# EAGLE design LNB (EAGLE 7.3.0)

## Sheet 1 of 2
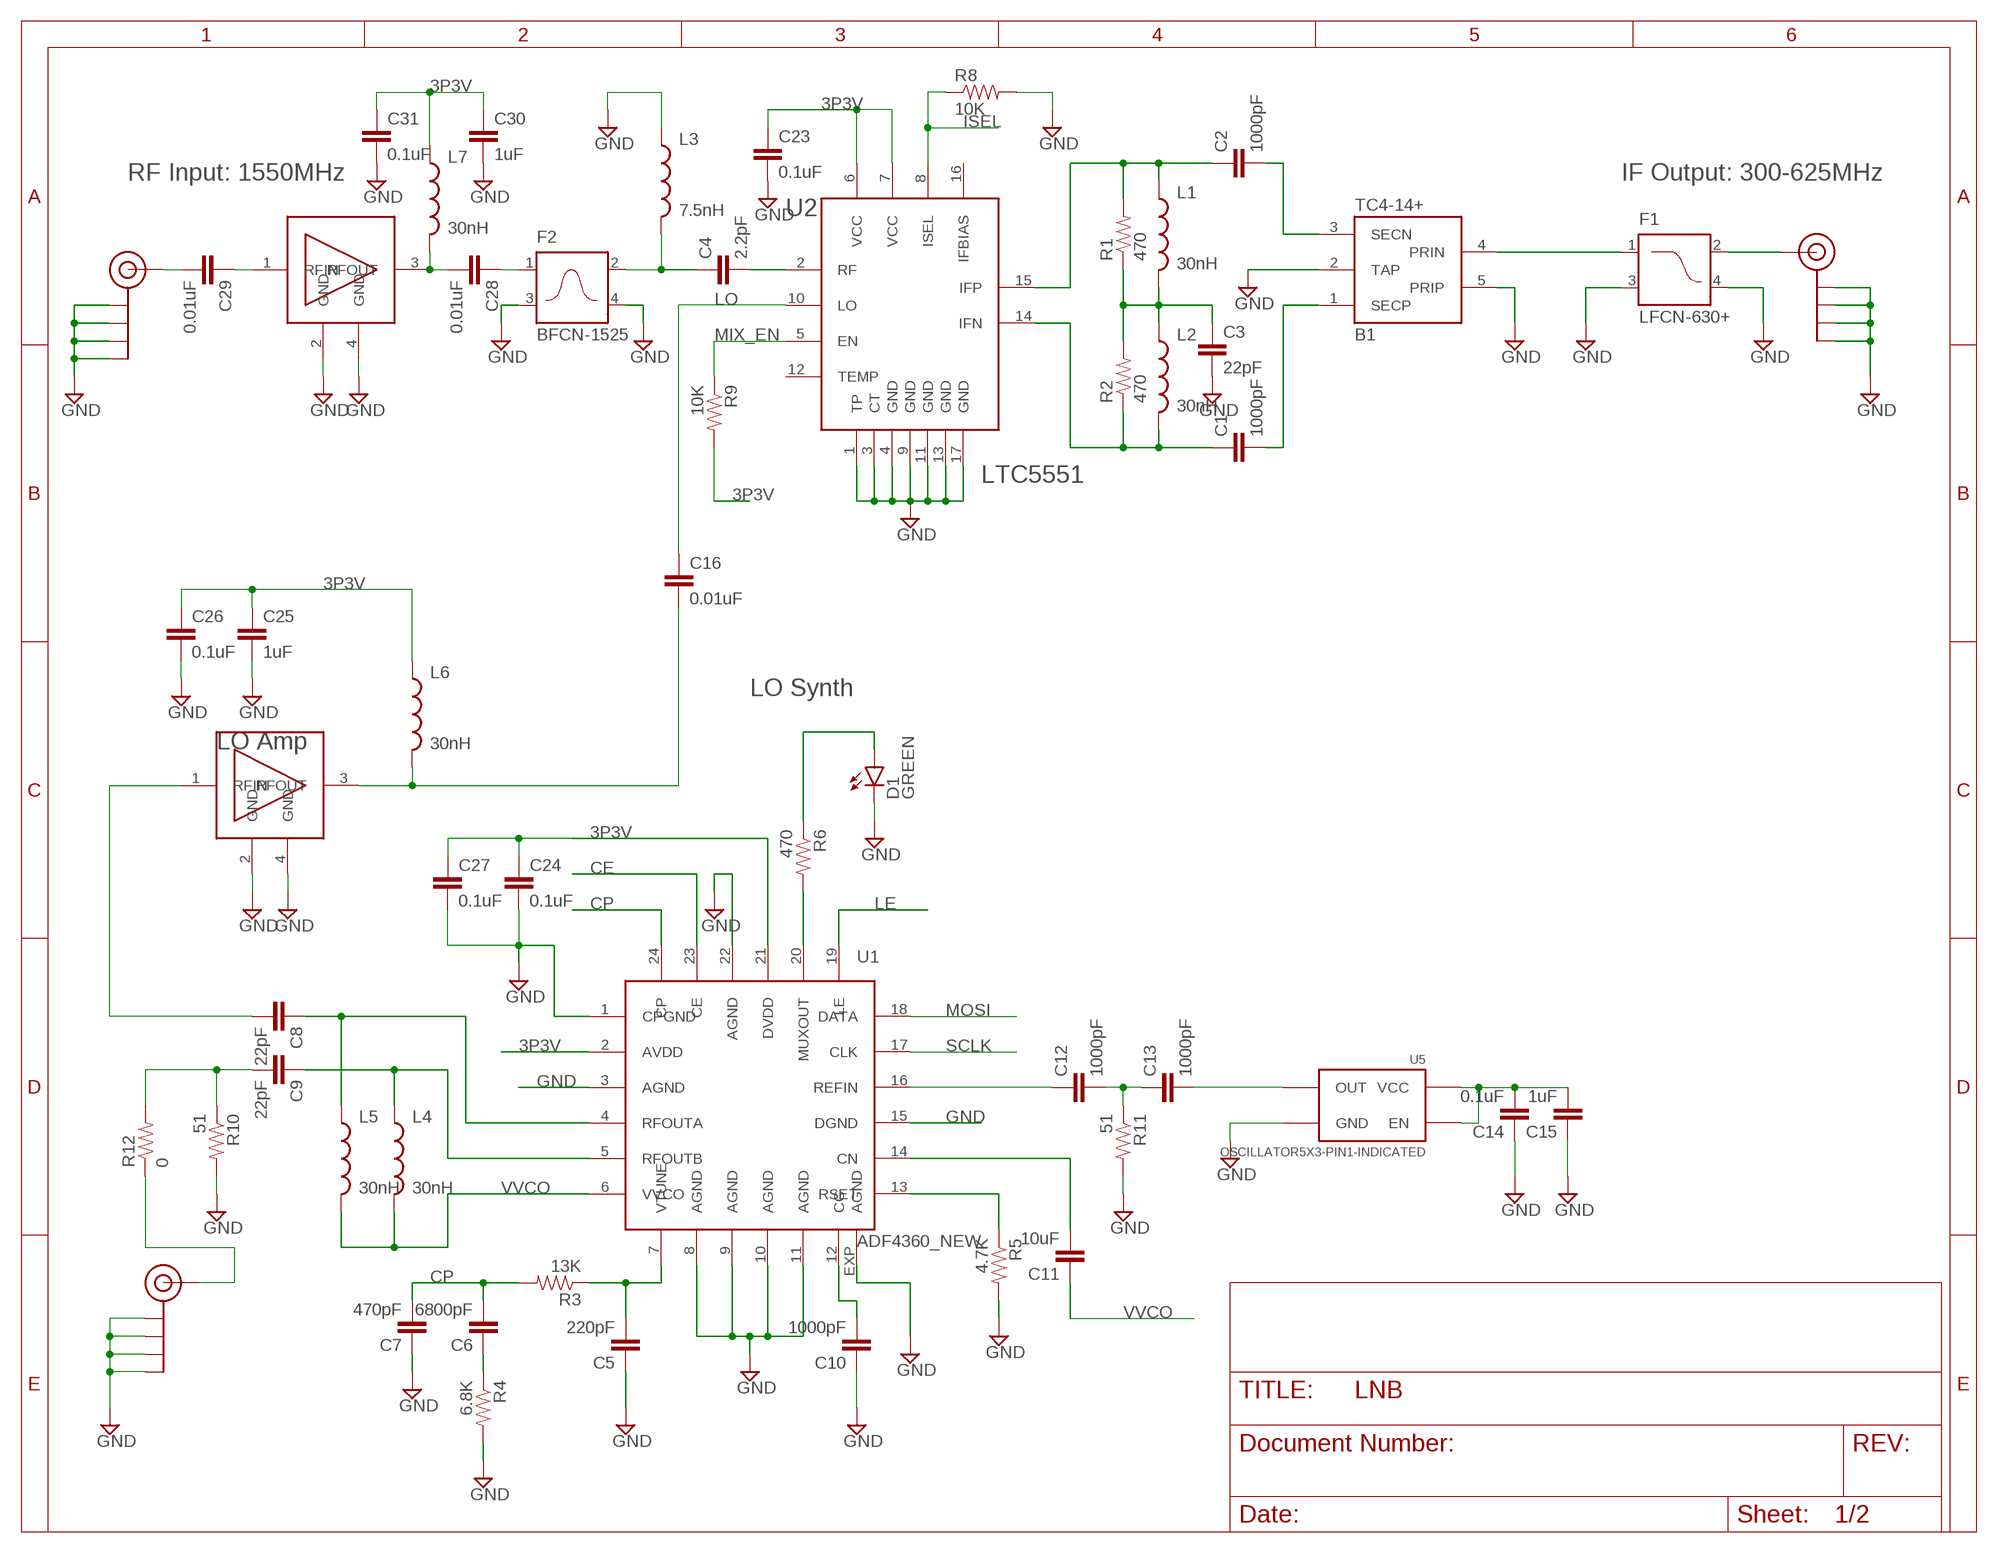
[diagram p0: schematic, sheet 1]

### Parts
B1  TC4-14+  [AT224-1]
C1  1000pF  CAP0603-CAP  [0603-CAP]
C2  1000pF  CAP0603-CAP  [0603-CAP]
C3  22pF  CAP0603-CAP  [0603-CAP]
C4  2.2pF  CAP0603-CAP  [0603-CAP]
C5  220pF  CAP0603-CAP  [0603-CAP]
C6  6800pF  CAP0603-CAP  [0603-CAP]
C7  470pF  CAP0603-CAP  [0603-CAP]
C8  22pF  CAP0603-CAP  [0603-CAP]
C9  22pF  CAP0603-CAP  [0603-CAP]
C10  1000pF  CAP0603-CAP  [0603-CAP]
C11  10uF  CAP0603-CAP  [0603-CAP]
C12  1000pF  CAP0603-CAP  [0603-CAP]
C13  1000pF  CAP0603-CAP  [0603-CAP]
C14  0.1uF  CAP0603-CAP  [0603-CAP]
C15  1uF  CAP0603-CAP  [0603-CAP]
C16  0.01uF  CAP0603-CAP  [0603-CAP]
C23  0.1uF  CAP0603-CAP  [0603-CAP]
C24  0.1uF  CAP0603-CAP  [0603-CAP]
C25  1uF  CAP1206  [1206]
C26  0.1uF  CAP0603-CAP  [0603-CAP]
C27  0.1uF  CAP0603-CAP  [0603-CAP]
C28  0.01uF  CAP0603-CAP  [0603-CAP]
C29  0.01uF  CAP0603-CAP  [0603-CAP]
C30  1uF  CAP1206  [1206]
C31  0.1uF  CAP0603-CAP  [0603-CAP]
D1  GREEN  LED-GREEN0603  [LED-0603]
F1  LFCN-630+  [FV1206_MC]
F2  BFCN-1525  [FV1206_MC]
J2  SMA_EDGE  [SMA-EDGE]
J3  SMA_EDGE  [SMA-EDGE]
J$1  SMA_EDGE  [SMA-EDGE]
L1  30nH  INDUCTOR30OHM,1.8A  [0603]
L2  30nH  INDUCTOR30OHM,1.8A  [0603]
L3  7.5nH  INDUCTOR30OHM,1.8A  [0603]
L4  30nH  INDUCTOR30OHM,1.8A  [0603]
L5  30nH  INDUCTOR30OHM,1.8A  [0603]
L6  30nH  INDUCTOR30OHM,1.8A  [0603]
L7  30nH  INDUCTOR30OHM,1.8A  [0603]
R1  470  RESISTOR0603-RES  [0603-RES]
R2  470  RESISTOR0603-RES  [0603-RES]
R3  13K  RESISTOR0603-RES  [0603-RES]
R4  6.8K  RESISTOR0603-RES  [0603-RES]
R5  4.7K  RESISTOR0603-RES  [0603-RES]
R6  470  RESISTOR0603-RES  [0603-RES]
R8  10K  RESISTOR0603-RES  [0603-RES]
R9  10K  RESISTOR0603-RES  [0603-RES]
R10  51  RESISTOR0603-RES  [0603-RES]
R11  51  RESISTOR0603-RES  [0603-RES]
R12  0  RESISTOR0603-RES  [0603-RES]
U1  ADF4360_NEW  [LFCSP24]
U2  LTC5551  [QFN16-4X4]
U5  OSCILLATOR5X3-PIN1-INDICATED  [CRYSTAL-OSC-SMD-5X3]
U6  PGA-105+  [SOT-89]
U7  PGA-105+  [SOT-89]

### Nets
3P3V: C14.2 C15.2 C23.1 C24.1 C25.1 C26.1 C27.1 C30.1 C31.1 L6.1 L7.1 R9.2 U1.2(AVDD) U1.21(DVDD) U2.6(VCC) U2.7(VCC) U5.1(EN) U5.4(VCC) ; also sheet 2
CE: U1.23(CE) ; also sheet 2
CP: C6.2 C7.2 R3.2 U1.24(CP)
GND: B1.2(TAP) B1.5(PRIP) C3.2 C5.1 C7.1 C10.1 C14.1 C15.1 C23.2 C24.2 C25.2 C26.2 C27.2 C30.2 C31.2 D1.C F1.3(GND) F1.4(GND) F2.3(GND) F2.4(GND) J2.GND@0(GND) J2.GND@1(GND) J2.GND@2(GND) J2.GND@3(GND) J3.GND@0(GND) J3.GND@1(GND) J3.GND@2(GND) J3.GND@3(GND) J$1.GND@0(GND) J$1.GND@1(GND) J$1.GND@2(GND) J$1.GND@3(GND) L3.1 R4.2 R5.2 R8.2 R10.2 R11.2 U1.1(CPGND) U1.3(AGND) U1.8(AGND) U1.9(AGND) U1.10(AGND) U1.11(AGND) U1.15(DGND) U1.22(AGND) U1.EXP(AGND) U2.1(TP) U2.3(CT) U2.4(GND) U2.9(GND) U2.11(GND) U2.13(GND) U2.17(GND) U5.2(GND) U6.2(GND) U6.4(GND) U7.2(GND) U7.4(GND) ; also sheet 2
ISEL: R8.1 U2.8(ISEL) ; also sheet 2
LE: U1.19(LE) ; also sheet 2
LO: C16.1 U2.10(LO)
LO_IN: C8.2 U7.1(RFIN)
MIX_EN: R9.1 U2.5(EN) ; also sheet 2
MOSI: U1.18(DATA) ; also sheet 2
N$1: C2.1 L1.1 R1.2 U2.15(IFP)
N$2: C1.1 L2.2 R2.1 U2.14(IFN)
N$3: C3.1 L1.2 L2.1 R1.1 R2.2
N$4: B1.1(SECP) C1.2
N$5: B1.3(SECN) C2.2
N$6: B1.4(PRIN) F1.1(IN)
N$7: F1.2(OUT) J$1.SIG(SIGNAL)
N$8: C29.2 J2.SIG(SIGNAL)
N$9: C4.1 F2.2(OUT) L3.2
N$10: C4.2 U2.2(RF)
N$11: C5.2 R3.1 U1.7(VTUNE)
N$12: C11.2 U1.14(CN)
N$13: C6.1 R4.1
N$14: C8.1 L5.1 U1.4(RFOUTA)
N$15: C9.1 L4.1 U1.5(RFOUTB)
N$16: C10.2 U1.12(CC)
N$17: D1.A R6.1
N$18: R5.1 U1.13(RSET)
N$19: R6.2 U1.20(MUXOUT)
N$21: C9.2 R10.1 R12.2
N$23: C29.1 U6.1(RFIN)
N$25: C12.2 C13.1 R11.1
N$26: C13.2 U5.3(OUT)
N$27: C12.1 U1.16(REFIN)
N$28: C16.2 L6.2 U7.3(RFOUT)
N$31: J3.SIG(SIGNAL) R12.1
N$33: C28.2 L7.2 U6.3(RFOUT)
N$34: C28.1 F2.1(IN)
SCLK: U1.17(CLK) ; also sheet 2
VVCO: C11.1 L4.2 L5.2 U1.6(VVCO)
Unconnected: U2.12(TEMP) U2.16(IFBIAS)

### Notes on the sheet
- RF Input: 1550MHz | IF Output: 300-625MHz
- U2
- LTC5551
- LO Synth
- LO Amp

## Sheet 2 of 2
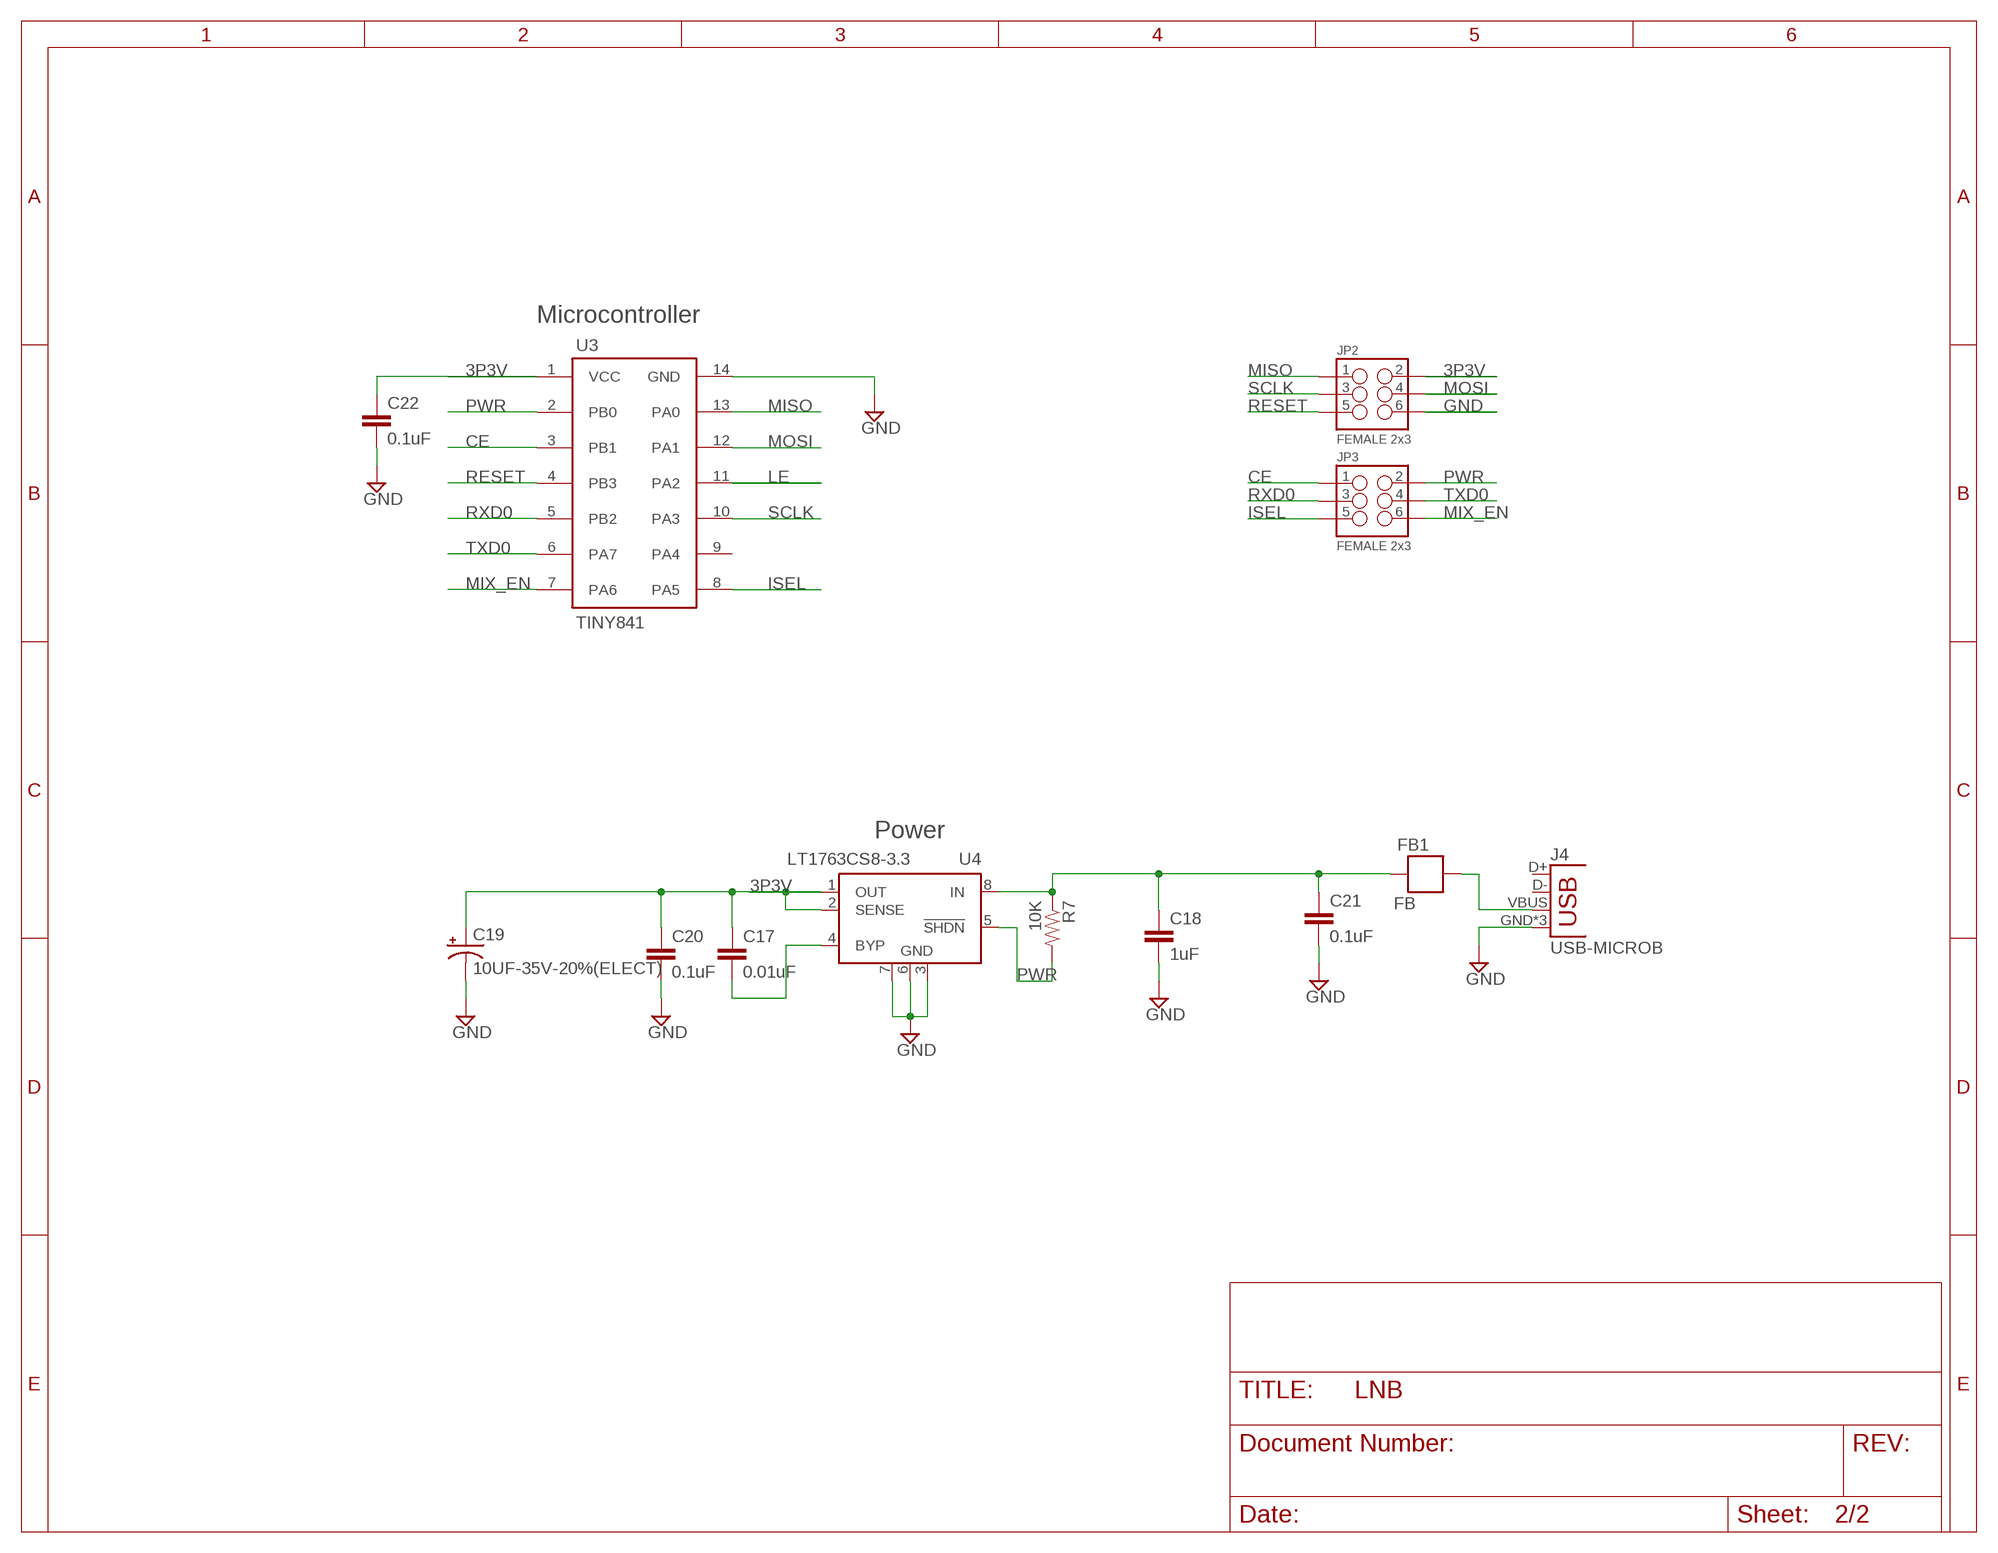
[diagram p1: schematic, sheet 2]

### Parts
C17  0.01uF  CAP0603-CAP  [0603-CAP]
C18  1uF  CAP1206  [1206]
C19  10UF-35V-20%(ELECT)  [PANASONIC_C]
C20  0.1uF  CAP0603-CAP  [0603-CAP]
C21  0.1uF  CAP0603-CAP  [0603-CAP]
C22  0.1uF  CAP0603-CAP  [0603-CAP]
FB1  FB  [0603]
J4  USB-MICROB  [USB-MICROB]
JP2  FEMALE 2x3  M03X2FEMALE  [2X3]
JP3  FEMALE 2x3  M03X2FEMALE  [2X3]
R7  10K  RESISTOR0603-RES  [0603-RES]
U3  TINY841  [SOIC14]
U4  LT1763CS8-3.3  [SOIC8]

### Nets
3P3V: C17.1 C19.+ C20.1 C22.1 JP2.2 U3.1(VCC) U4.1(OUT) U4.2(SENSE) ; also sheet 1
CE: JP3.1 U3.3(PB1) ; also sheet 1
GND: C18.2 C19.- C20.2 C21.2 C22.2 J4.GND J4.MT1(GND) J4.MT2(GND) JP2.6 U3.14(GND) U4.3(GND) U4.6(GND) U4.7(GND) ; also sheet 1
ISEL: JP3.5 U3.8(PA5) ; also sheet 1
LE: U3.11(PA2) ; also sheet 1
MISO: JP2.1 U3.13(PA0)
MIX_EN: JP3.6 U3.7(PA6) ; also sheet 1
MOSI: JP2.4 U3.12(PA1) ; also sheet 1
N$20: FB1.1 J4.VBUS
N$22: C18.1 C21.1 FB1.2 R7.1 U4.8(IN)
N$30: C17.2 U4.4(BYP)
PWR: JP3.2 R7.2 U3.2(PB0) U4.5(!SHDN)
RESET: JP2.5 U3.4(PB3)
RXD0: JP3.3 U3.5(PB2)
SCLK: JP2.3 U3.10(PA3) ; also sheet 1
TXD0: JP3.4 U3.6(PA7)
Unconnected: J4.D+ J4.D- U3.9(PA4)

### Notes on the sheet
- Microcontroller
- Power

## Library data of the parts
B1 = minicircuits:TC4-14+
C1-C18 C20-C31 = SparkFun-Passives:CAP: Capacitor Standard 0603 ceramic capacitor, and 0.1" leaded capacitor.
C19 = SparkFun-Capacitors:10UF-35V-20%(ELECT)
D1 = SparkFun-LED:LED-GREEN: Various green LEDs Green LEDs used in SFE Production 0603- DIO-00821 LARGE- DIO-00862 LILYPAD- DIO-09910; PROD_ID: DIO-00821
F1 = minicircuits:LFCN-630+
F2 = minicircuits:BFCN-1525: Mini-Circuits LTCC Bandpass Filter in FV1206 package. BFCN-1525+ 1480 to 1570 MHz.
FB1 = SparkFun-Passives:FB
J2 J3 J$1 = SparkFun-Connectors:SMA_EDGE: SMA Antenna Connector End launch SMA connector. The paste layer has been removed so that the connector can be hand soldered onto the board after reflow.
J4 = SparkFun-Connectors:USB: USB Connectors USB-B-PTH is fully proven SKU : PRT-00139/CONN-08278 USB-miniB is fully proven SKU : PRT-00587 USB-A-PCB is untested. USB-A-H is throughly reviewed, but untested. Spark Fun Electronics SKU : PRT-00437 USB-B-SMT is throughly reviewed, but untested. Needs silkscreen touching up. USB-A-S has not been used/tested USB-MB-H has not been used/tested USB-MICROB has been used. CONN-09505; PROD_ID: CONN-09505
JP2 JP3 = SparkFun-Connectors:M03X2: 2x3 .1" header. Shrouded, with keying- CONN-10681 SMT- CONN-11415 Pogo pins- HW-11044; PROD_ID: CONN-11566
L1-L7 = SparkFun-Passives:INDUCTOR: Inductors Basic Inductor/Choke - 0603 and 1206. Footprints are not proven and vary greatly between part numbers. SRN6045- 33uH, 20% 1.4A SDR0403-560KL - 56uH, 10%, 500mA RMS/740mA peak; PROD_ID: RES-07859
R1-R12 = SparkFun-Passives:RESISTOR: Resistor Basic schematic elements and footprints for 0603, 1206, and PTH resistors.
U1 = adf4360:ADF4360_NEW
U2 = linear-technology:LTC5551
U3 = atmel:TINY841
U4 = linear-technology:LT1763CS8: 500mA, Low Noise, LDO Micropower Regulators Source: http://cds.linear.com/docs/Datasheet/1763ff.pdf
U5 = SparkFun-FreqCtrl:OSCILLATOR: Generic 5x3 and 7x5 oscillators
U6 U7 = minicircuits:PGA-105+

## Board
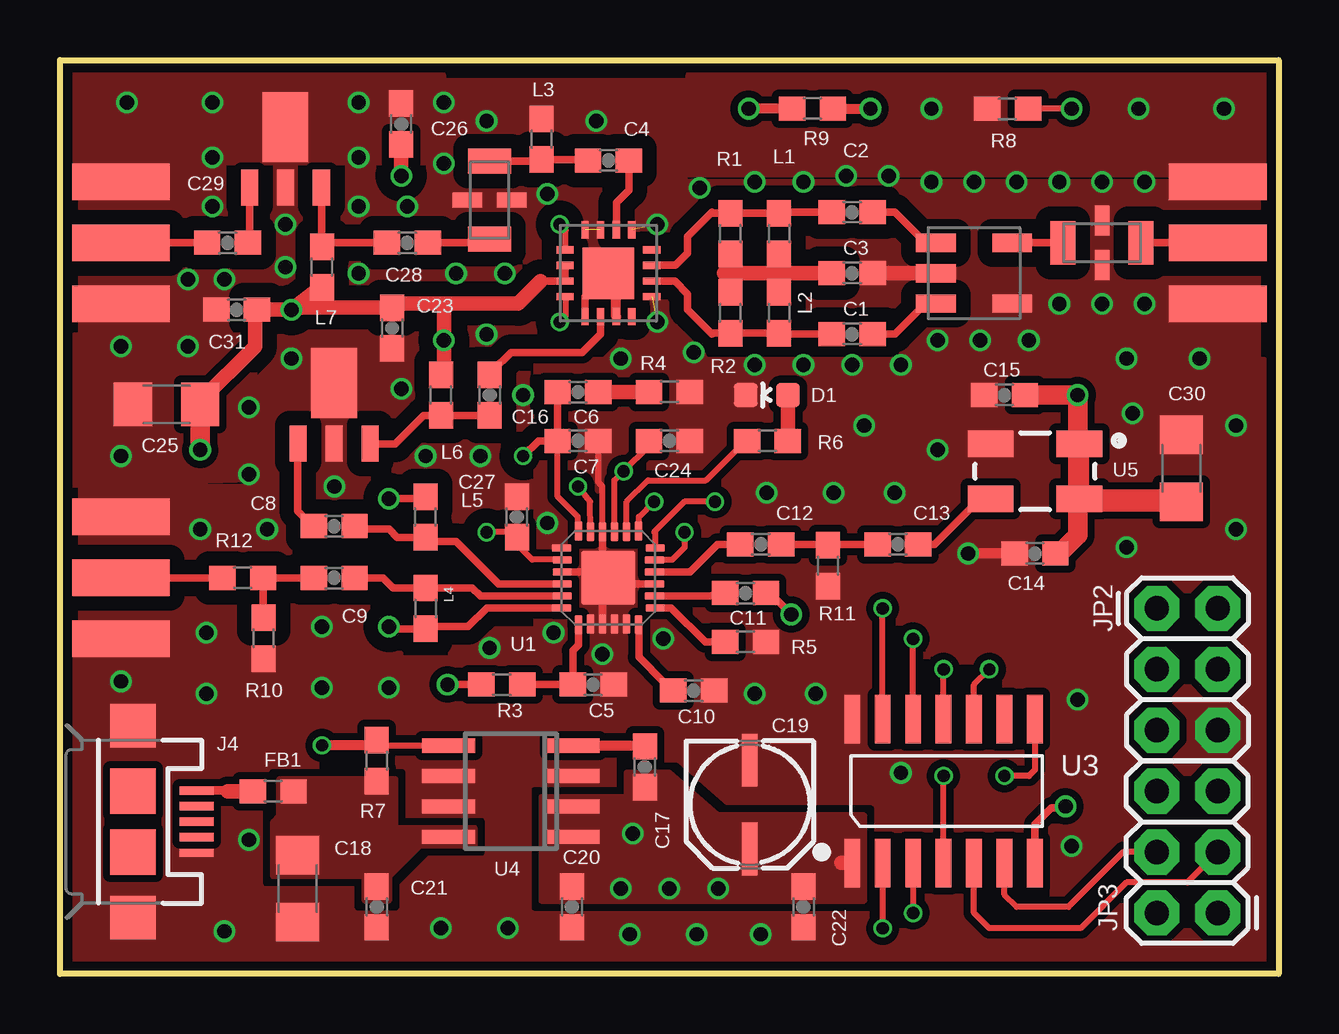
[diagram p2: board, top side]
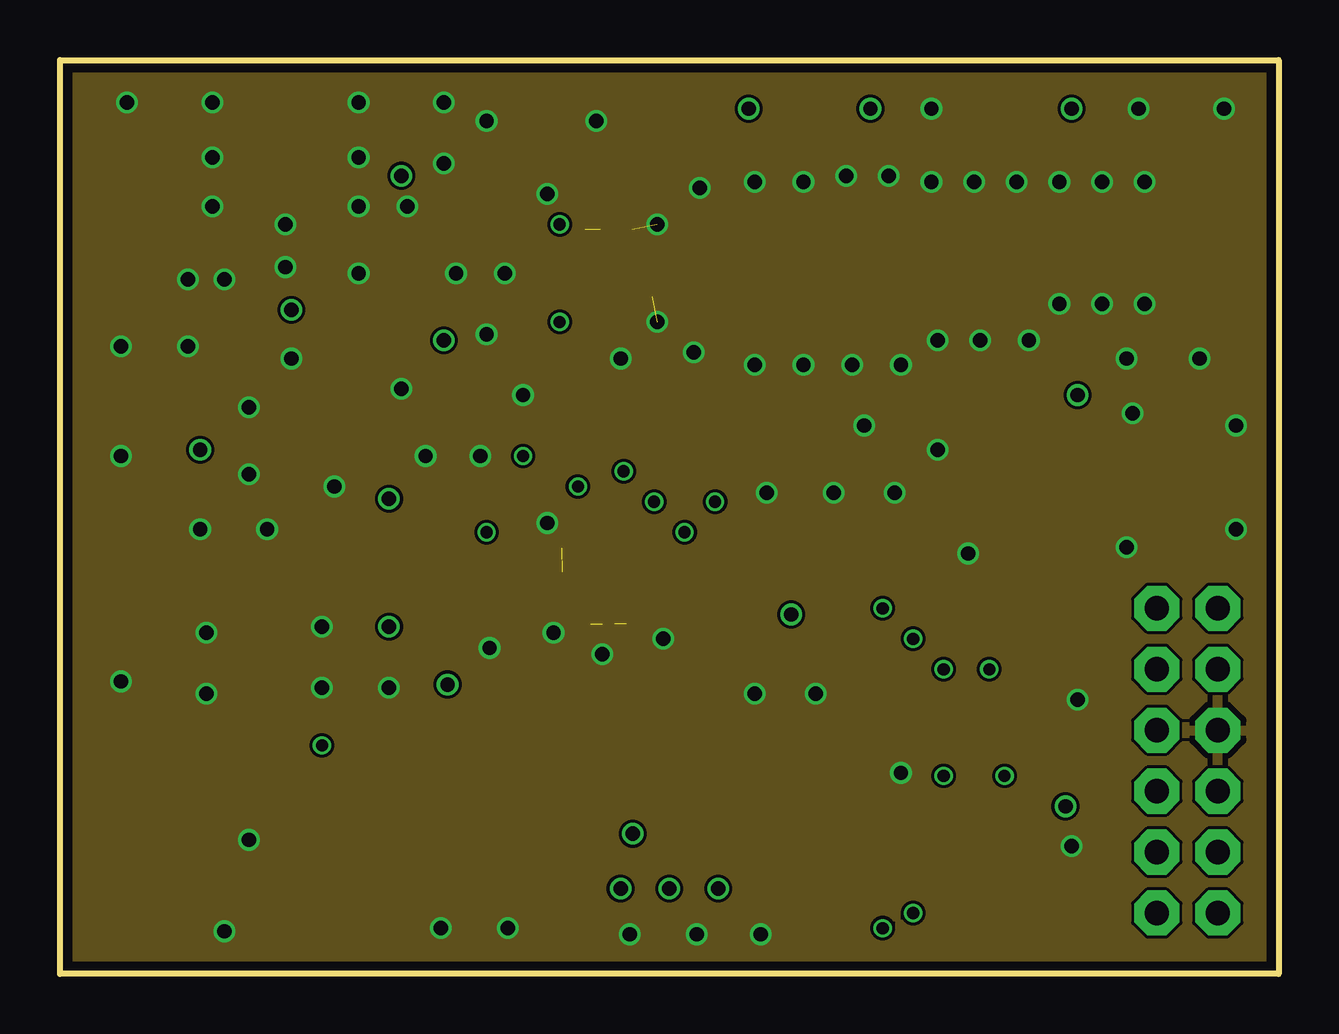
[diagram p3: board, inner layer Route2]
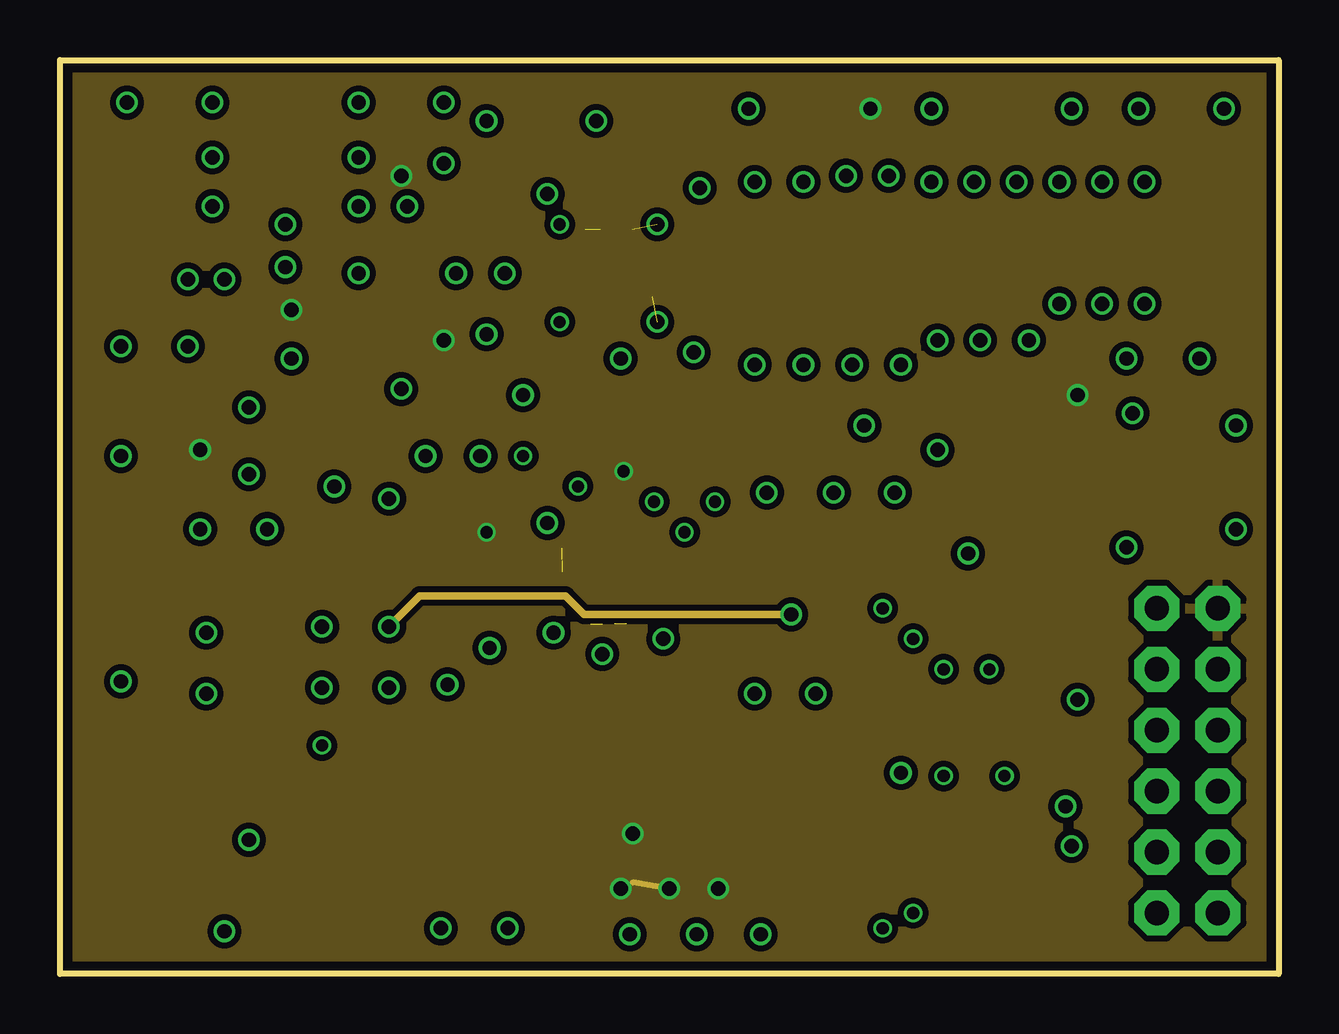
[diagram p4: board, inner layer Route15]
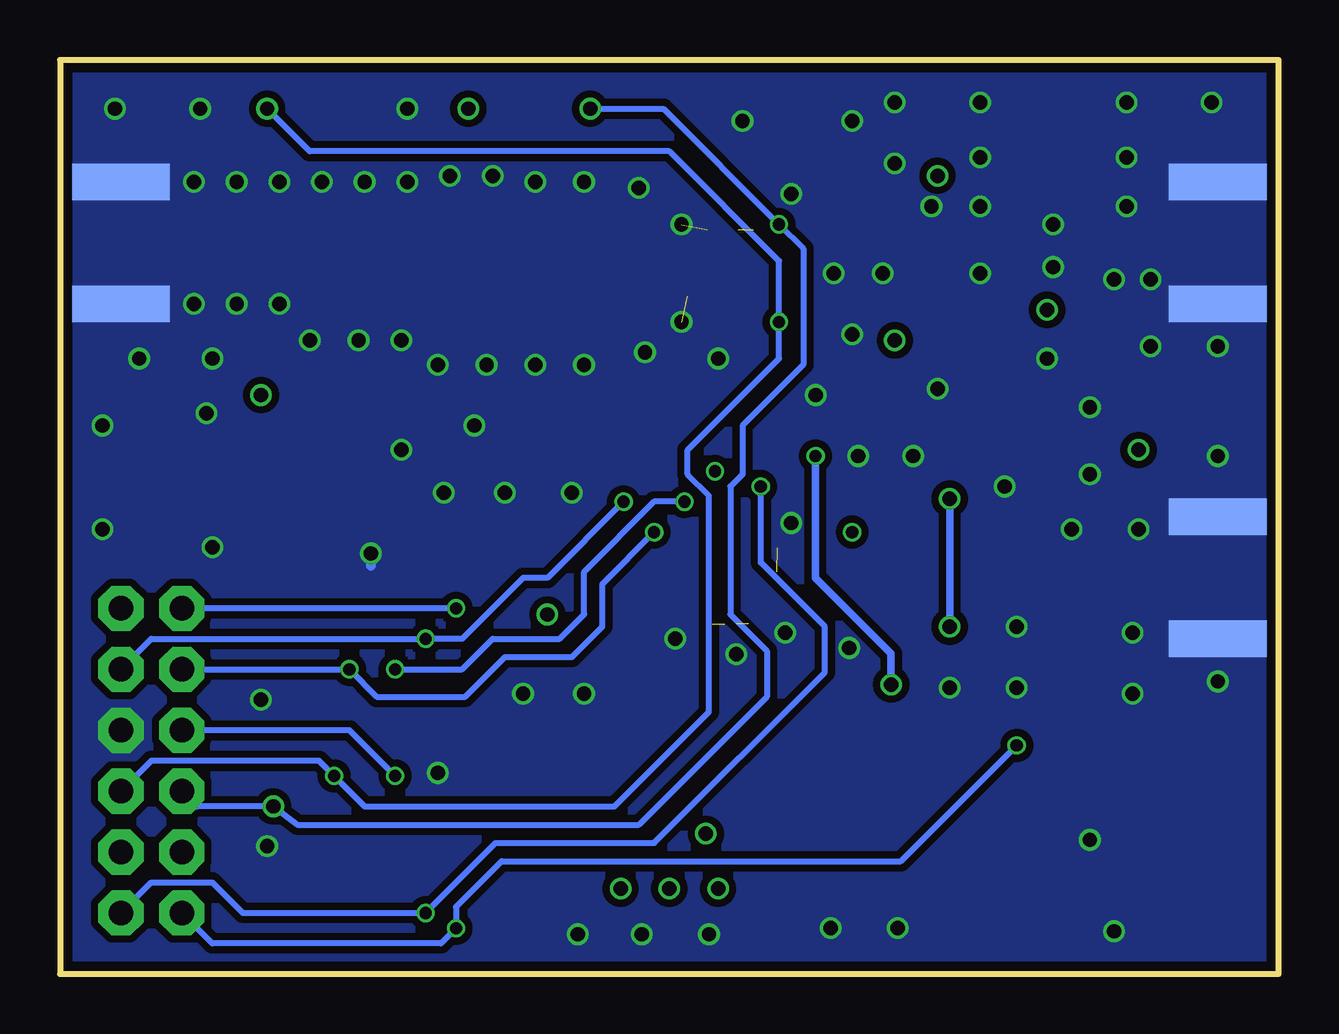
[diagram p5: board, bottom side, seen from below]

Size 50.8 x 38.1 mm. Coordinates in mm from the lower left corner, seen from the top.
Outline: 0,0 0,38.1 50.8,38.1 50.8,0 0,0
Copper layers (1*2*15*16): Top 0.035559375mm / dielectric 0.17018125mm / Route2 0.01778125mm / dielectric 47mil / Route15 0.01778125mm / dielectric 0.17018125mm / Bottom 0.035559375mm
Design rules "OSHPark-4layer": minimum track width 5mil, minimum drill 10mil, track to track 5mil, track to pad 5mil, pad to pad 5mil, via to via 5mil, smd to smd 5mil, copper to edge 15mil, drill to drill 6mil, minimum pad ring 4mil, minimum via ring 4mil, stop-mask expansion 4mil, vias tented up to drill 0mil, thermal gap 10mil

### Footprints (pad centres in the part's own frame; a part is rotated, then mirrored left to right if it is on the bottom)
AT224-1 = smd 0.762 x 1.651: 1 -1.27,1.587; 2 0,1.587; 3 1.27,1.587; 4 1.27,-1.587; 5 -1.27,-1.587
0603-CAP = smd 1.1 x 1: 1 -0.85,0; 2 0.85,0
1206 = smd 1.6 x 1.8: 1 -1.4,0; 2 1.4,0
PANASONIC_C = smd 2.2 x 0.65: + 1.9,-0.2; - -1.8,-0.2
LED-0603 = smd 1 x 1: A 0,-0.877; C 0,0.877
FV1206_MC = smd 1.041 x 1.803: 1 -1.626,0; 2 1.626,0 | smd 0.61 x 1.245: 3 0,-0.927; 4 0,0.927
0603 = smd 1.1 x 1: 1 -0.85,0; 2 0.85,0
SMA-EDGE = smd 1.524 x 4.064: GND@0 0,0; GND@1 5.08,0; SIG 2.54,0 | smd 1.524 x 4.064 bottom: GND@2 0,0; GND@3 5.08,0
USB-MICROB = smd 0.35 x 1.4: D+ 0,2.65; D- -0.65,2.65; GND 1.3,2.65; ID 0.65,2.65; VBUS -1.3,2.65 | smd 1.8 x 1.9: MT1 -4,0; MT2 4,0 | smd 1.9 x 1.9: P$1 -1.27,0; P$2 1.27,0
2X3 = drill 1.016 pad 1.88 octagon: 1 0,0; 2 0,2.54; 3 2.54,0; 4 2.54,2.54; 5 5.08,0; 6 5.08,2.54
0603-RES = smd 1.1 x 1: 1 -0.85,0; 2 0.85,0
LFCSP24 = smd 0.8 x 0.3: 1 -1.95,1.25; 2 -1.925,0.75; 3 -1.925,0.25; 4 -1.925,-0.25; 5 -1.925,-0.75; 6 -1.95,-1.25; 13 1.95,-1.25; 14 1.925,-0.75; 15 1.925,-0.25; 16 1.925,0.25; 17 1.925,0.75; 18 1.95,1.25 | smd 0.3 x 0.8: 7 -1.25,-1.95; 8 -0.75,-1.925; 9 -0.25,-1.925; 10 0.25,-1.925; 11 0.75,-1.925; 12 1.25,-1.95; 19 1.25,1.95; 20 0.75,1.925; 21 0.25,1.925; 22 -0.25,1.925; 23 -0.75,1.925; 24 -1.25,1.95 | smd 2.25 x 2.25: EXP 0,0
QFN16-4X4 = smd 0.72 x 0.3: 1 -1.81,0.975; 2 -1.81,0.325; 3 -1.81,-0.325; 4 -1.81,-0.975; 9 1.81,-0.975; 10 1.81,-0.325; 11 1.81,0.325; 12 1.81,0.975 | smd 0.3 x 0.72: 5 -0.975,-1.81; 6 -0.325,-1.81; 7 0.326,-1.81; 8 0.975,-1.81; 13 0.975,1.81; 14 0.326,1.81; 15 -0.325,1.81; 16 -0.975,1.81 | smd 2.15 x 2.15: 17 0,0
SOIC14 = smd 2.032 x 0.66: 1 -2.997,3.81; 2 -2.997,2.54; 3 -2.997,1.27; 4 -2.997,0; 5 -2.997,-1.27; 6 -2.997,-2.54; 7 -2.997,-3.81; 8 2.997,-3.81; 9 2.997,-2.54; 10 2.997,-1.27; 11 2.997,0; 12 2.997,1.27; 13 2.997,2.54; 14 2.997,3.81
SOIC8 = smd 0.6 x 2.2: 1 -1.905,-2.6; 2 -0.635,-2.6; 3 0.635,-2.6; 4 1.905,-2.6; 5 1.905,2.6; 6 0.635,2.6; 7 -0.635,2.6; 8 -1.905,2.6
CRYSTAL-OSC-SMD-5X3 = smd 1.9 x 1.1: 1 -1.85,-1.15; 2 1.85,-1.15; 3 1.85,1.15; 4 -1.85,1.15
SOT-89 = smd 0.711 x 1.499: 1 -1.499,-0.749; 2 0,-0.749; 3 1.499,-0.749 | smd 1.905 x 2.921: 4 0,1.778

### Placement (x,y rotation side)
B1  38.1,29.21 90 top
C1  33.02,26.67 0 top
C2  33.02,31.75 0 top
C3  33.02,29.21 0 top
C4  22.86,33.91 0 top
C5  22.23,12.06 180 top
C6  21.59,24.26 180 top
C7  21.59,22.23 180 top
C8  11.43,18.67 180 top
C9  11.43,16.51 180 top
C10  26.42,11.81 180 top
C11  28.57,15.88 180 top
C12  29.21,17.91 0 top
C13  34.92,17.91 0 top
C14  40.64,17.53 0 top
C15  39.37,24.13 0 top
C16  17.91,24.13 270 top
C17  24.38,8.64 90 top
C18  9.91,3.56 270 top
C19  28.96,7.11 270 top
C20  21.34,2.79 270 top
C21  13.21,2.79 270 top
C22  30.99,2.79 270 top
C23  13.84,26.92 270 top
C24  25.4,22.23 0 top
C25  4.45,23.75 180 top
C26  14.22,35.43 90 top
C27  19.05,19.05 90 top
C28  14.48,30.48 180 top
C29  6.99,30.48 180 top
C30  46.74,21.08 90 top
C31  7.37,27.69 180 top
D1  29.46,24.13 90 top
F1  43.43,30.48 0 top
F2  17.91,32.26 90 top
FB1  8.89,7.62 0 top
J2  2.54,33.02 270 top
J3  2.54,13.97 90 top
J4  3.05,6.35 270 top
J$1  48.26,27.94 90 top
JP2  45.72,15.24 270 top
JP3  48.26,2.54 90 top
L1  29.97,30.86 270 top
L2  29.97,27.56 270 top
L3  20.07,34.8 270 top
L4  15.24,15.24 270 top
L5  15.24,19.05 90 top
L6  15.88,24.13 270 top
L7  10.92,29.46 90 top
R1  27.94,30.86 90 top
R2  27.94,27.56 90 top
R3  18.41,12.06 180 top
R4  25.4,24.26 0 top
R5  28.57,13.84 0 top
R6  29.49,22.23 180 top
R7  13.21,8.89 90 top
R8  39.5,36.07 180 top
R9  31.37,36.07 0 top
R10  8.48,14 270 top
R11  32,17.02 270 top
R12  7.62,16.51 0 top
U1  22.86,16.51 0 top
U2  22.86,29.21 270 top
U3  36.83,7.62 90 top
U4  18.8,7.62 90 top
U5  40.64,20.95 180 top
U6  9.4,33.53 0 top
U7  11.43,22.86 0 top

### Tracks (layer width: path | path; a pad name or v marks a point on that pad's centre or on a via)
3P3V  (via drill 0.51, 0.6)
  Top 0.254: U1.21 23.11,20.57 v23.5,20.95 24.55,22.01 C24.1 | U1.2 20.92,17.27 19.68,17.27 19.05,17.91 C27.1 18.84,18.41 v17.78,18.41
  Top 0.305: 20.04,28.88 U2.7 U2.6
  Top 0.406: R9.2 v33.78,36.07
  Top 0.61: U3.1 32.56,4.62 | 20.04,28.88 19.1,27.94 16,27.94 | 15.88,25.27 15.75,25.15 15.75,25.11 L6.1 15.88,25.27 | 16,27.94 v16,26.42 16,25.4 15.88,25.27 | C26.1 v14.22,33.27 | L7.1 10.83,28.61 v9.65,27.69 | C31.1 v9.65,27.69 | C25.1 5.84,23.88 8.13,26.16 8.13,27.69 | 16,27.94 14.39,27.94 C23.1 9.74,27.77 v9.65,27.69
  Top 0.813: U5.4 45.97,19.81 C30.1 42.55,19.68 42.42,19.81 42.42,21.84 42.67,22.1 | C14.2 41.66,17.53 42.42,18.29 42.42,19.73 U5.4 | U5.4 U5.1 42.42,22.18 v42.42,24.13 C15.2 | C25.1 5.84,23.62 v5.84,21.84
  Route15 0.254: v25.4,3.56 23.88,3.81
  other vias: 27.43,3.56 23.37,3.56 23.88,5.84
  pour Route15 (isolate 0.254): 0.64,37.47 50.16,37.47 50.16,0.64 0.64,0.64
  pour Top (no thermals): 20.07,3.05 33.53,3.05 33.53,6.6 27.43,6.6 25.4,8.38 23.62,8.38 23.62,7.37 20.07,7.37
CE  (via drill 0.51)
  Top 0.254: U3.3 v35.56,2.54 | U1.23 22.1,19.68 v21.59,20.32
  Bottom 0.254: JP3.1 46.99,3.81 44.45,3.81 43.18,2.54 v35.56,2.54 32.64,5.46 26.04,5.46 18.92,12.57 18.92,14.48 21.59,17.14 v21.59,20.32
CP  (via drill 0.51, 0.6)
  Top 0.254: U1.24 21.59,18.48 21.59,19.05 20.74,19.9 C7.2
  Top 0.305: v19.3,21.59 19.94,22.23 C7.2 C6.2 | v16.15,12.06 R3.2
  Bottom 0.305: v19.3,21.59 19.3,16.51 16.15,13.36 v16.15,12.06
GND  (via drill 0.6)  (6 unrouted)
  Top 0.254: U1.22 22.61,20.32 22.44,20.49 C7.1
  Top 0.305: U2.9 21.89,28.23 U2.17 | U1.9 22.61,16.26 U1.EXP | U1.3 22.61,16.76 | U1.15 24.89,16.26 23.11,16.26 U1.EXP | U1.22 22.61,16.76 | 22.61,16.76 U1.EXP
  Top 0.406: C14.1 v37.85,17.53 | U2.11 23.18,28.89 U2.17
  Top 0.61: C3.2 B1.2
  Bottom 0.406: v37.85,17.53 37.85,17.02
  other vias: 45.21,27.94 43.43,27.94 41.66,27.94 24.89,31.24 24.89,27.18 26.42,25.91 28.96,25.4 30.99,25.4 33.02,25.4 35.05,25.4 36.58,26.42 38.35,26.42 40.39,26.42 20.32,18.8 20.57,14.22 25.15,13.97 26.54,1.65 29.21,1.65 22.61,13.34 45.21,33.02 43.43,33.02 41.66,33.02 39.88,33.02 38.1,33.02 36.32,33.02 30.99,33.02 34.54,33.27 32.77,33.27 28.96,33.02 26.67,32.77 23.37,25.65 17.78,26.67 19.3,24.13 17.53,21.59 15.24,21.59 14.22,24.38 18.54,29.21 16.51,29.21 12.45,29.21 9.65,25.65 9.4,31.24 9.4,29.46 6.86,28.96 5.33,28.96 6.35,32 6.35,34.04 12.45,32 14.48,32 16,33.78 17.78,35.56 22.35,35.56 20.32,32.51 12.45,34.04 12.45,36.32 16,36.32 6.35,36.32 2.79,36.32 5.33,26.16 2.54,26.16 2.54,21.59 7.87,23.62 7.87,20.83 8.64,18.54 6.1,14.22 5.84,18.54 11.43,20.32 6.1,11.68 10.92,14.48 10.92,11.94 13.72,11.94 2.54,12.19 35.05,8.38 42.16,5.33 29.46,20.07 32.26,20.07 34.8,20.07 36.58,21.84 33.53,22.86 44.45,25.65 47.5,25.65 44.7,23.37 49.02,22.86 49.02,18.54 36.32,36.07 44.96,36.07 48.51,36.07 44.45,17.78 42.42,11.43 17.91,13.59 28.96,11.68 31.5,11.68 7.87,5.59 6.86,1.78 23.75,1.65 18.67,1.91 15.88,1.91
  pour Route2: 0.64,37.47 50.16,37.47 50.16,0.64 0.64,0.64
  pour Top (isolate 0.305, rank 2, no thermals): 0.64,13.08 50.16,13.08 50.16,0.64 0.64,0.64
  pour Bottom (isolate 0.305, no thermals): 0.64,37.47 50.16,37.47 50.16,0.64 0.64,0.64
  pour Top (isolate 0.61, no thermals): 0.64,33.66 15.88,33.66 15.88,37.47 26.04,37.47 26.04,33.02 50.16,33.02 50.16,25.4 23.5,25.4 23.5,24.13 19.68,24.13 19.68,17.78 22.86,17.78 22.86,13.34 0.64,13.34 0.64,20.32 8.26,20.32 8.26,26.67 0.64,26.67
  pour Top (isolate 0.305, rank 2, no thermals): 0.64,37.47 15.88,37.47 15.88,33.91 0.64,33.91
  pour Top (isolate 0.305, rank 2, no thermals): 26.29,37.47 50.16,37.47 50.16,33.4 26.29,33.4
  pour Top (isolate 0.305, rank 2, no thermals): 0.64,26.54 8,26.54 8,20.7 0.64,20.45
  pour Top (isolate 0.305, rank 2, no thermals): 19.94,25.53 50.16,25.53 50.16,13.08 19.94,13.08
ISEL  (via drill 0.51, 0.6)
  Top 0.254: U2.8 21.08,28.2 21.08,27.43 v20.83,27.18 | v42.16,36.07 R8.1 | U3.8 40.64,8.51 40.39,8.26 v39.37,8.26
  Bottom 0.254: v42.16,36.07 40.39,34.29 25.4,34.29 20.83,29.72 v20.83,27.18 20.83,25.65 24.64,21.84 24.64,20.83 23.75,19.94 23.75,10.92 27.69,6.99 38.1,6.99 v39.37,8.26 40.01,8.89 46.99,8.89 JP3.5
LE  (via drill 0.51)
  Top 0.254: U3.11 v36.83,12.7 | U1.19 24.13,18.48 24.13,19.05 v24.77,19.68
  Bottom 0.254: v24.77,19.68 26.04,19.68 28.96,16.76 28.96,14.99 29.97,13.97 32.77,13.97 34.04,12.7 v36.83,12.7
LO
  Top 0.305: U2.10 22.53,26.67 21.77,25.91 18.8,25.91 18.03,25.15 C16.1
LO_IN
  Top 0.305: U7.1 9.91,22.09 9.91,19.3 10.54,18.67 C8.2
MISO  (via drill 0.51)
  Top 0.254: U3.13 v34.29,15.24
  Bottom 0.254: v34.29,15.24 JP2.1
MIX_EN  (via drill 0.51, 0.6)
  Top 0.254: U2.5 21.08,30.22 21.08,30.99 v20.83,31.24
  Top 0.305: U3.7 40.64,6.25 41.31,6.92 41.85,6.92 v41.91,6.99
  Top 0.406: R9.1 v28.7,36.07
  Bottom 0.254: v28.7,36.07 25.65,36.07 v20.83,31.24 19.81,30.23 19.81,25.4 22.35,22.86 22.35,20.83 22.86,20.32 22.86,14.99 21.34,13.46 21.34,11.56 26.67,6.22 40.89,6.22 v41.91,6.99 45.09,6.99 JP3.6
MOSI  (via drill 0.51)
  Top 0.254: U3.12 v35.56,13.97 | U1.18 24.81,18.37 24.77,18.41 26.04,19.68 v27.3,19.68
  Bottom 0.254: JP2.4 46.99,13.97 v35.56,13.97 34.04,13.97 31.5,16.51 30.48,16.51 v27.3,19.68
N$1
  Top 0.305: U2.15 25.65,29.54 26.16,30.05 26.16,30.73 27.18,31.75 27.22,31.71 R1.2 L1.1 29.88,31.75 C2.1
N$2
  Top 0.305: U2.14 25.63,28.88 26.16,28.35 26.16,27.69 27.18,26.67 27.22,26.71 R2.1 L2.2 29.88,26.67 C1.1
N$3
  Top 0.61: C3.1 29.97,29.21 | 29.97,29.21 27.94,29.21 | 27.94,29.21 27.69,29.21 | R1.1 27.94,29.21 | R2.2 27.94,29.21 | L2.1 29.97,29.21 | L1.2 29.97,29.21
N$4
  Top 0.305: B1.1 36.07,27.94 34.8,26.67 C1.2
N$5
  Top 0.305: B1.3 36.07,30.48 34.8,31.75 C2.2
N$6
  Top 0.305: B1.4 F1.1
N$7
  Top 0.305: F1.2 J$1.SIG
N$8
  Top 0.305: J2.SIG C29.2
N$9
  Top 0.305: F2.2 20,33.88 L3.2 21.97,33.95 C4.1
N$10
  Top 0.305: U2.2 23.19,32.16 23.71,32.68 C4.2
N$11
  Top 0.305: U1.7 21.61,13.72 21.38,13.48 C5.2 R3.1
N$12
  Top 0.305: U1.14 24.8,15.75 27.18,15.75 27.3,15.88 C11.2
N$13
  Top 0.61: C6.1 R4.1
N$14
  Top 0.305: C8.1 12.41,18.54 13.72,18.54 14.06,18.2 L5.1 15.41,18.03 16.51,18.03 18.28,16.26 U1.4
N$15
  Top 0.305: U1.5 20.92,15.75 17.53,15.75 17.18,16.09 L4.1 13.88,16.09 13.46,16.51 C9.1
N$16
  Top 0.305: U1.12 24.13,14.54 24.13,13.21 25.18,12.15 C10.2
N$17
  Top 0.61: R6.1 D1.A
N$18
  Top 0.305: U1.13 25.48,15.27 26.9,13.84 R5.1
N$19
  Top 0.254: U1.20 23.62,18.45 23.62,19.68 24.51,20.57 26.92,20.57 28.57,22.23 R6.2
N$20
  Top 0.356: J4.VBUS 6.96,7.65
  Top 0.406: 6.96,7.65 6.99,7.62
  Top 0.61: 6.99,7.62 FB1.1
N$21
  Top 0.305: C9.2 R12.2 R10.1
N$22
  pour Top (no thermals): 9.14,8.13 13.97,8.13 13.97,6.1 17.27,6.1 17.27,5.33 14.99,5.33 13.72,4.06 13.72,3.05 12.7,3.05 12.7,4.06 8.89,4.06 8.89,6.35 9.14,6.6
N$23
  Top 0.305: 7.87,30.73 C29.1 7.9,30.54 U6.1
N$25
  Top 0.305: C13.1 32,17.91 | C12.2 32,17.91 | 32,17.91 R11.1
N$26
  Top 0.305: U5.3 38.35,19.8 36.45,17.91 C13.2
N$27
  Top 0.305: U1.16 26.26,16.76 27.41,17.91 C12.1
N$28
  Top 0.305: U7.3 12.94,22.1 13.97,22.1 15.15,23.28 L6.2 C16.2
N$30
  Top 0.406: U4.4 24.42,9.53 C17.2
N$31
  Top 0.305: R12.1 J3.SIG
N$33
  Top 0.305: U6.3 10.9,30.48 | 10.9,30.48 10.9,30.25 10.92,30.23 | C28.2 11.09,30.48 L7.2 10.92,30.45 10.9,30.48
N$34
  Top 0.305: C28.1 17.75,30.48 F2.1
PWR  (via drill 0.51)
  Top 0.254: U3.2 v34.29,1.91 | v10.92,9.53 U4.5
  Top 0.406: R7.2 13.2,9.54 v10.92,9.53
  Bottom 0.254: JP3.2 44.45,1.27 34.92,1.27 v34.29,1.91 34.29,2.79 32.38,4.7 15.75,4.7 v10.92,9.53
RESET  (via drill 0.51)
  Top 0.254: U3.4 v36.83,8.26
  Bottom 0.254: v36.83,8.26 38.73,10.16 JP2.5
RXD0
  Top 0.254: JP3.3 46.99,3.81 44.45,3.81 42.55,1.91 38.73,1.91 38.1,2.54 U3.5
SCLK  (via drill 0.51)
  Top 0.254: U3.10 38.1,12.06 v38.73,12.7 | v26.04,18.41 26.04,17.78 25.52,17.26 U1.17
  Bottom 0.254: JP2.3 v38.73,12.7 37.59,11.56 33.91,11.56 32.26,13.21 29.46,13.21 28.19,14.48 28.19,16.26 v26.04,18.41
TXD0
  Top 0.254: JP3.4 44.32,5.08 42.04,2.79 39.88,2.79 39.37,3.3 U3.6
VVCO  (via drill 0.6)
  Top 0.305: U1.6 17.8,15.26 17.02,14.48 15.33,14.48 L4.2 13.8,14.39 v13.72,14.48 | v13.72,19.81 15.15,19.81 L5.2 | C11.1 29.59,15.88 v30.48,14.99
  Route15 0.305: v30.48,14.99 21.84,14.99 21.08,15.75 14.99,15.75 v13.72,14.48
  Bottom 0.305: v13.72,14.48 v13.72,19.81